# Altium schematic sheet Схема блока MOSFET.SchDoc
size 420 x 297 mm; Address1: Address1; Address2: Address2; Address3: Address3; Address4: Address4; DocumentNumber: АБВГ.123456.001 Э3; SheetNumber: 1; Scale: 1:1; DocumentType: Схема электрическая принципиальная; FirstReferrence: АБВГ.123456.001
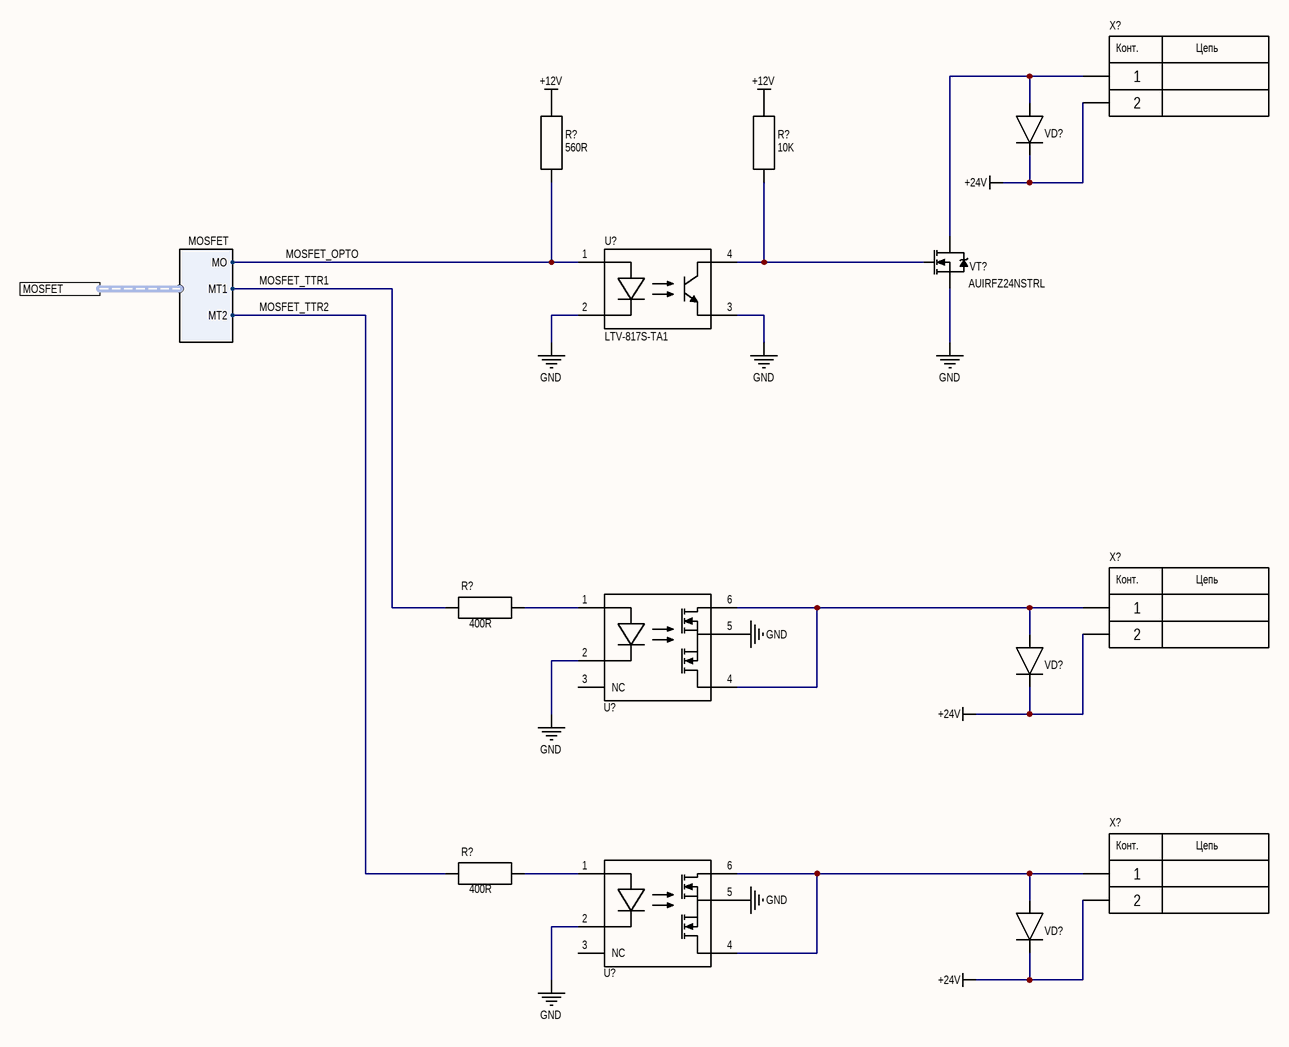
[diagram p0: Схема блока MOSFET.SchDoc]

## Parts
(Parts that share a designator on the sheet are numbered #1, #2 ... from top to bottom, then left to right.)
R?#1  560R  [CH0603R]
R?#2  10K  [CH0603R]
R?#3  400R  [CH0603R]
R?#4  400R  [CH0603R]
U?#1  LTV-817S-TA1  [4-SMD]
U?#2  LCA715S  [6-SMD]  (value not drawn)
U?#3  LCA715S  [6-SMD]  (value not drawn)
VD?#1  *  [DO35]  (value not drawn)
VD?#2  *  [DO35]  (value not drawn)
VD?#3  *  [DO35]  (value not drawn)
VT?  AUIRFZ24NSTRL  [DPAK]
X?#1  *  [CON: 300-02P-5.08]  (value not drawn)
X?#2  *  [CON: 300-02P-5.08]  (value not drawn)
X?#3  *  [CON: 300-02P-5.08]  (value not drawn)

## Ports
MOSFET (harness MOSFET)

## Harnesses
MOSFET: MT1, MT2, MO

## Nets
+12V: R?#1.2 R?#2.2
+24V: VD?#1.2 VD?#2.2 VD?#3.2 X?#1.2 X?#2.2 X?#3.2
GND: U?#1.2(C) U?#1.3(E) U?#2.2(C) U?#2.5(-L) U?#3.2(C) U?#3.5(-L) VT?.3(S)
MOSFET_OPTO: R?#1.1 U?#1.1(A) ; port MOSFET.MO
MOSFET_TTR1: R?#3.2 ; port MOSFET.MT1
MOSFET_TTR2: R?#4.2 ; port MOSFET.MT2
NetR?#2_1: R?#2.1 U?#1.4(C) VT?.1(G)
NetR?#3_1: R?#3.1 U?#2.1(A)
NetR?#4_1: R?#4.1 U?#3.1(A)
NetU?#2_4: U?#2.4(L) U?#2.6(+L) VD?#2.1 X?#2.1
NetU?#3_4: U?#3.4(L) U?#3.6(+L) VD?#3.1 X?#3.1
NetVD?#1_1: VD?#1.1 VT?.2(D) X?#1.1

Not connected (* = marked no-connect by the designer): U?#2 3(NC); U?#3 3(NC)

## Notes on the sheet
- Подп. и дата
- Инв. № дубл.
- Взам. инв. №
- Инв. № подл.
- Изм.
- Лист
- № докум.
- Подп.
- Дата
- 2.106-A3
- Копировал
- Формат А3
- (in symbol 2-Connector) Конт.; Цепь

## Library data of the parts
R?#1-R?#4 = Resistor
  R?#1: ComponentKind: 0603 (1608 Metric); Value: 560R
  R?#2: ComponentKind: 0603 (1608 Metric); Value: 10K
  R?#3 R?#4: Manufacturer: *; Model: *; HelpURL: *; ComponentKind: *; Value: 400R
U?#1 = Optoisol: Manufacturer: Lite-On Inc.; Model: LTV-817S-TA1; HelpURL: https://www.digikey.com/en/products/detail/lite-on-inc/LTV-817S-TA1/388451; ComponentKind: 4-SMD
U?#2 U?#3 = LCA715S: Solid State Relay; Manufacturer: IXYS Integrated Circuits Division; Model: LCA715S; HelpURL: https://www.digikey.com/en/products/detail/ixys-integrated-circuits-division/LCA715S/1973063; ComponentKind: 6-SMD
VD?#1-VD?#3 = Diod: ComponentKind: *; Manufacturer: *; Model: *; HelpURL: *
VT? = N-chanel: Mosfet; Manufacturer: Infineon Technologies; Model: AUIRFZ24NSTRL; ComponentKind: D-PAK (TO-252AA); HelpURL: https://www.digikey.com/en/products/detail/infineon-technologies/AUIRFZ24NSTRL/3454970
X?#1-X?#3 = 2-Connector: Model: *; Manufacturer: *; HelpURL: *; ComponentKind: *